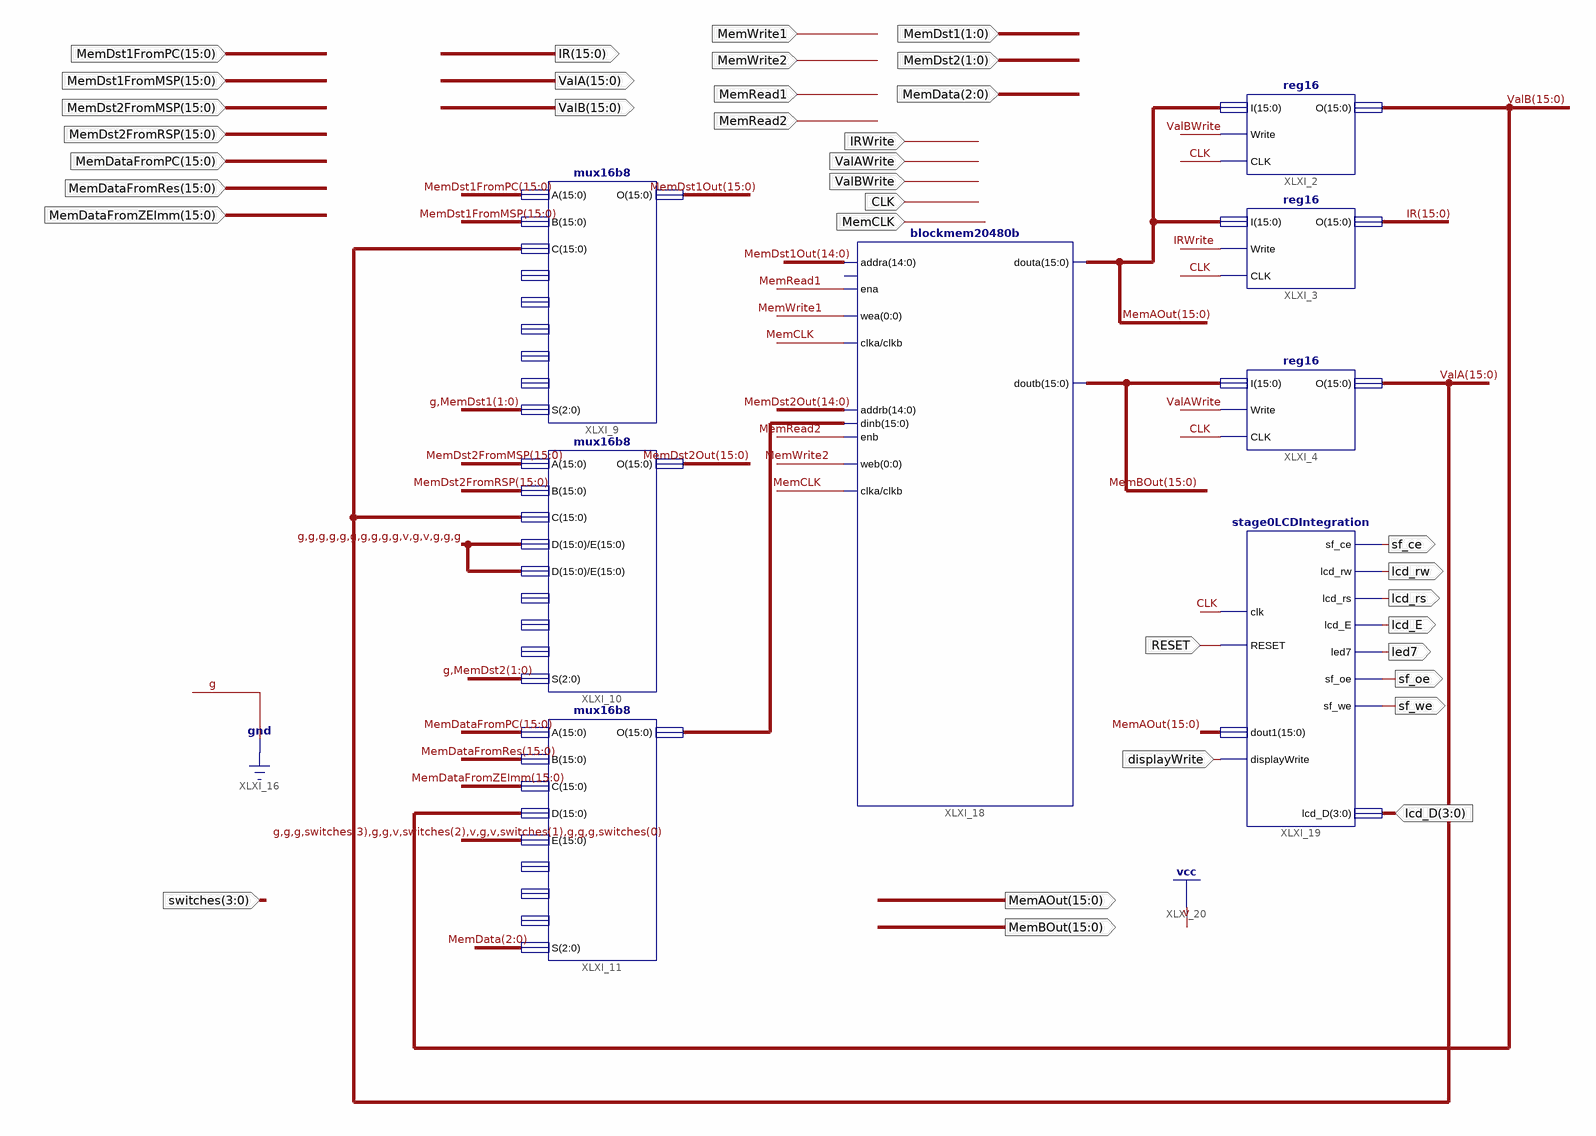
[diagram p0: schematic sheet 1]
// Xilinx ISE schematic stage2MemoryAccess.sch (spartan3e) as structural Verilog: 8 symbols, 35 ports
module stage2MemoryAccess (
  input  MemRead2,
  input  [15:0] MemDst1FromPC,
  input  [15:0] MemDst1FromMSP,
  input  [15:0] MemDst2FromMSP,
  input  [15:0] MemDst2FromRSP,
  input  [15:0] MemDataFromPC,
  input  [15:0] MemDataFromRes,
  input  [15:0] MemDataFromZEImm,
  input  MemWrite1,
  input  MemWrite2,
  input  MemRead1,
  input  ValBWrite,
  input  IRWrite,
  input  ValAWrite,
  input  CLK,
  input  [1:0] MemDst1,
  input  [1:0] MemDst2,
  input  [2:0] MemData,
  input  MemCLK,
  input  RESET,
  input  displayWrite,
  input  [3:0] switches,
  input  [3:0] lcd_D,
  output [15:0] ValB,
  output [15:0] ValA,
  output [15:0] IR,
  output [15:0] MemBOut,
  output [15:0] MemAOut,
  output sf_ce,
  output lcd_rw,
  output lcd_rs,
  output lcd_E,
  output led7,
  output sf_oe,
  output sf_we
);

  wire g;
  wire [15:0] MemBIn, MemDst1Out, MemDst2Out;

  mux16b8 XLXI_9 (
    .A(MemDst1FromPC), .B(MemDst1FromMSP), .C(ValA), .S({g, MemDst1}), .O(MemDst1Out));  // open: D, E, F, G, H
  mux16b8 XLXI_10 (
    .A(MemDst2FromMSP), .B(MemDst2FromRSP), .C(ValA), .D({{10{g}}, 1'b1, g, 1'b1, {3{g}}}),
    .E({{10{g}}, 1'b1, g, 1'b1, {3{g}}}), .S({g, MemDst2}), .O(MemDst2Out));  // open: F, G, H
  mux16b8 XLXI_11 (
    .A(MemDataFromPC), .B(MemDataFromRes), .C(MemDataFromZEImm), .D(ValB),
    .E({{3{g}}, switches[3], {2{g}}, 1'b1, switches[2], 1'b1, g, 1'b1, switches[1], {3{g}}, switches[0]}),
    .S(MemData), .O(MemBIn));  // open: F, G, H
  reg16 XLXI_2 (.I(MemAOut), .Write(ValBWrite), .CLK(CLK), .O(ValB));
  reg16 XLXI_4 (.I(MemBOut), .Write(ValAWrite), .CLK(CLK), .O(ValA));
  reg16 XLXI_3 (.I(MemAOut), .Write(IRWrite), .CLK(CLK), .O(IR));
  blockmem20480b XLXI_18 (
    .addra(MemDst1Out[14:0]), .ena(MemRead1), .wea(MemWrite1), .clka(MemCLK), .addrb(MemDst2Out[14:0]),
    .dinb(MemBIn), .enb(MemRead2), .web(MemWrite2), .clkb(MemCLK), .douta(MemAOut), .doutb(MemBOut));  // open: dina
  stage0LCDIntegration XLXI_19 (
    .displayWrite(displayWrite), .clk(CLK), .RESET(RESET), .dout1(MemAOut), .sf_ce(sf_ce), .sf_oe(sf_oe),
    .sf_we(sf_we), .lcd_rw(lcd_rw), .lcd_rs(lcd_rs), .lcd_E(lcd_E), .led7(led7), .lcd_D(lcd_D));
  // also tied to GND on the sheet: g
endmodule
